# EAGLE schematic shematic (EAGLE 7.1.0)
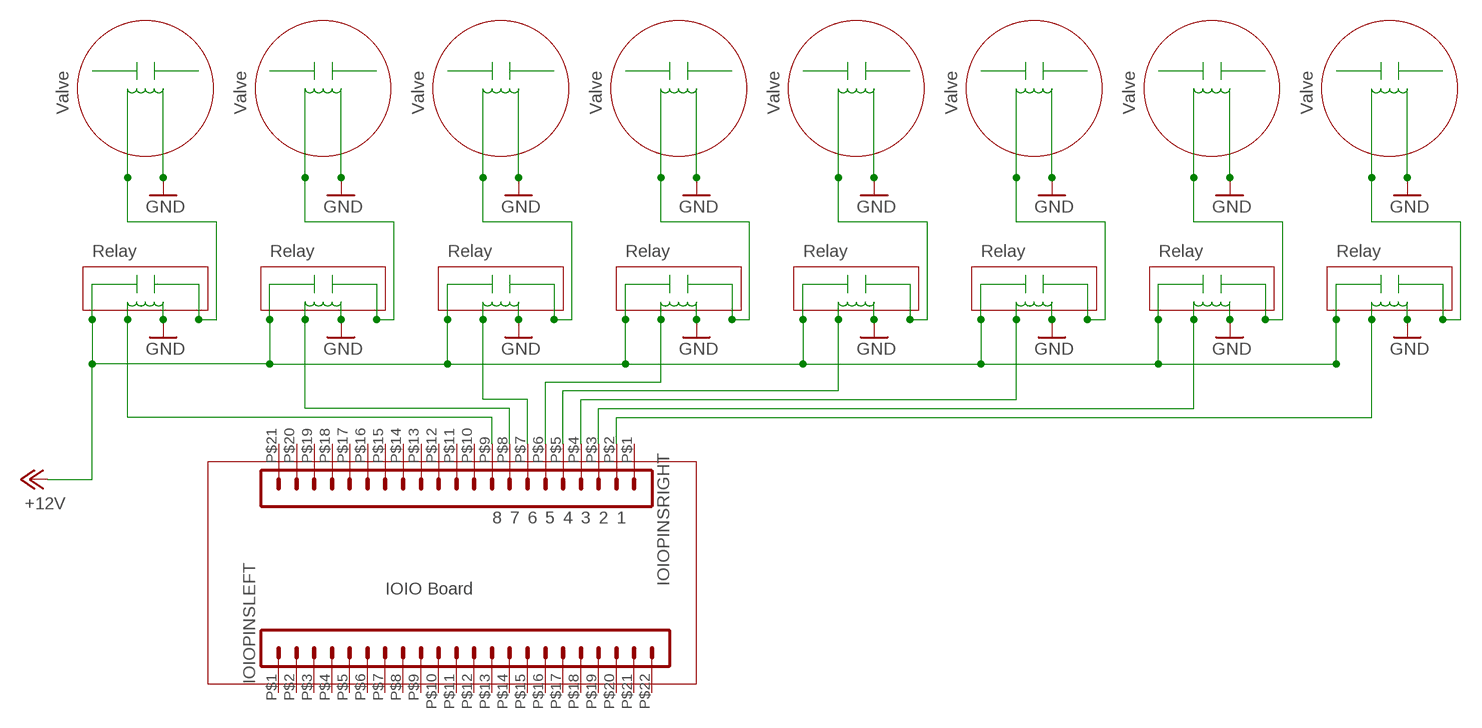
[diagram p0: schematic, sheet 1]

## Parts
IOIOPINSLEFT  HEADER_POS22_70543  [70543-POS22]
IOIOPINSRIGHT  HEADER_POS21_70543  [70543-POS21]

## Nets
GND: IOIOPINSRIGHT.P$2 IOIOPINSRIGHT.P$3 IOIOPINSRIGHT.P$4 IOIOPINSRIGHT.P$5 IOIOPINSRIGHT.P$6 IOIOPINSRIGHT.P$7 IOIOPINSRIGHT.P$8 IOIOPINSRIGHT.P$9
Unconnected: IOIOPINSLEFT.P$1 IOIOPINSLEFT.P$2 IOIOPINSLEFT.P$3 IOIOPINSLEFT.P$4 IOIOPINSLEFT.P$5 IOIOPINSLEFT.P$6 IOIOPINSLEFT.P$7 IOIOPINSLEFT.P$8 IOIOPINSLEFT.P$9 IOIOPINSLEFT.P$10 IOIOPINSLEFT.P$11 IOIOPINSLEFT.P$12 IOIOPINSLEFT.P$13 IOIOPINSLEFT.P$14 IOIOPINSLEFT.P$15 IOIOPINSLEFT.P$16 IOIOPINSLEFT.P$17 IOIOPINSLEFT.P$18 IOIOPINSLEFT.P$19 IOIOPINSLEFT.P$20 IOIOPINSLEFT.P$21 IOIOPINSLEFT.P$22 IOIOPINSRIGHT.P$1 IOIOPINSRIGHT.P$10 IOIOPINSRIGHT.P$11 IOIOPINSRIGHT.P$12 IOIOPINSRIGHT.P$13 IOIOPINSRIGHT.P$14 IOIOPINSRIGHT.P$15 IOIOPINSRIGHT.P$16 IOIOPINSRIGHT.P$17 IOIOPINSRIGHT.P$18 IOIOPINSRIGHT.P$19 IOIOPINSRIGHT.P$20 IOIOPINSRIGHT.P$21

## Notes on the sheet
- Valve | Valve | Valve | Valve | Valve | Valve | Valve | Valve
- Relay | Relay | Relay | Relay | Relay | Relay | Relay | Relay
- 8 | 7 | 6 | 5 | 4 | 3 | 2 | 1
- IOIO Board

## Library data of the parts
IOIOPINSLEFT = con-molex-c-grid-sl:HEADER_POS22_?: Molex -C-Grid® / SL Series connector Wire-to-Board 2.54 mm (0.100") pitch header, 22 positions.
IOIOPINSRIGHT = con-molex-c-grid-sl:HEADER_POS21_?: Molex -C-Grid® / SL Series connector Wire-to-Board 2.54 mm (0.100") pitch header, 21 positions.